# Altium project PCB Blue Pill.PrjPcb
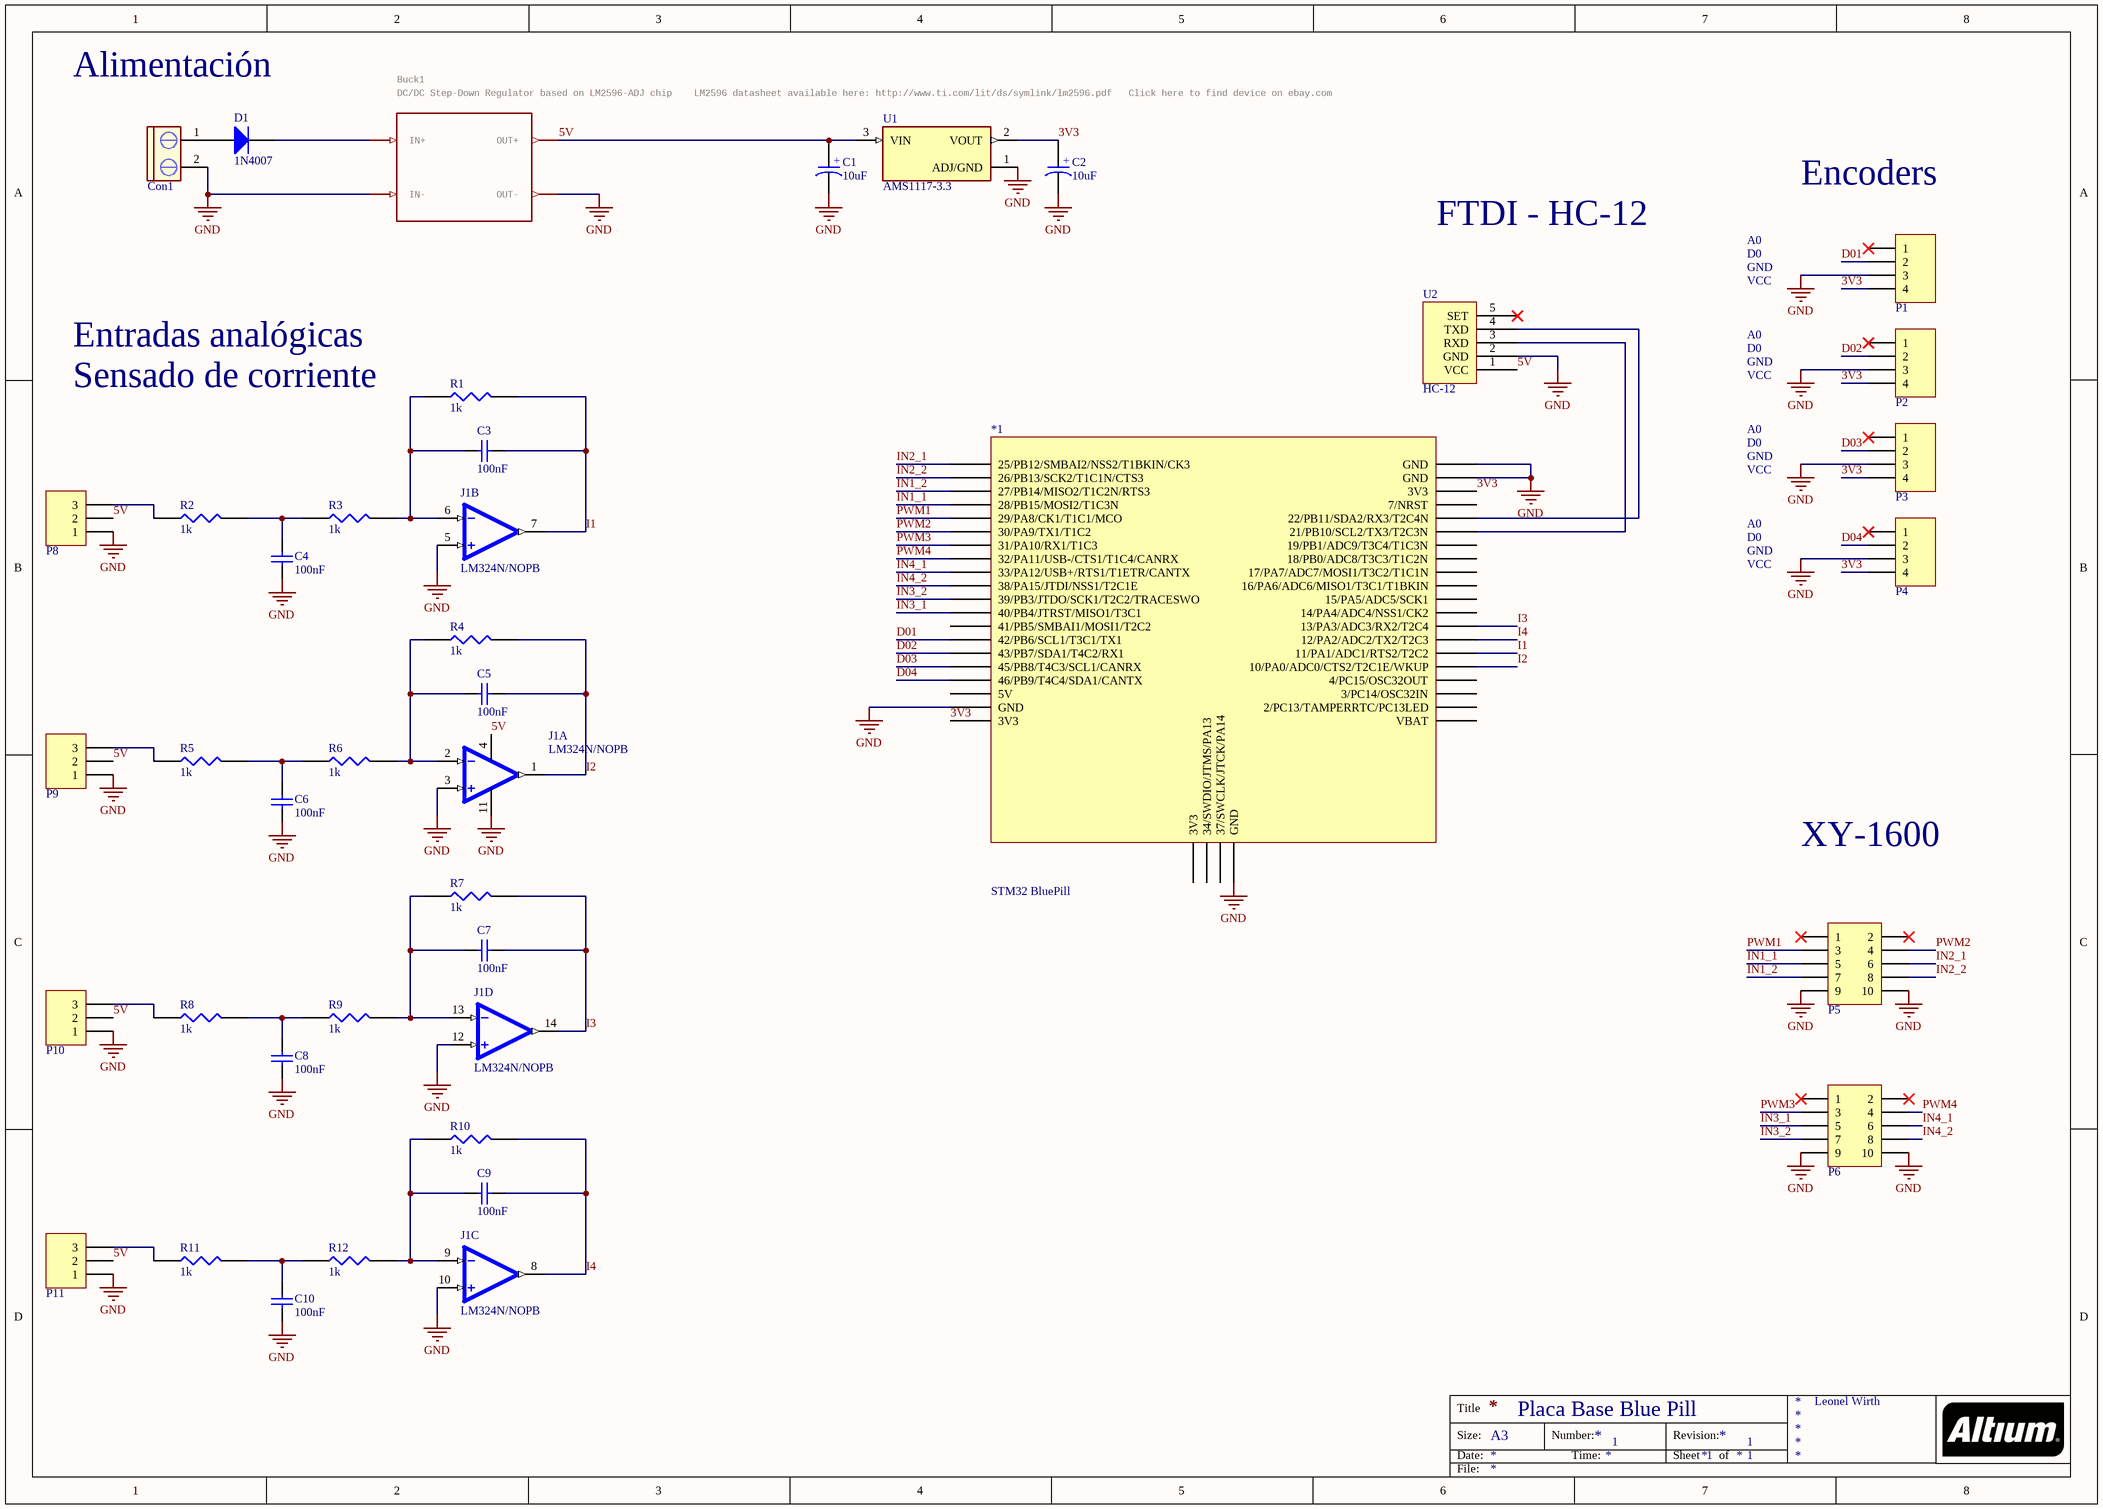
[diagram p0: Placa Base Blue Pill.SchDoc]
1 sheet, 39 parts. Net scope: global (net labels, ports and power ports of the same name join across sheets).
Board file: PCB Placa Base Blue Pill.PcbDoc

## Sheet Placa Base Blue Pill.SchDoc
size A3

### Parts
*1  STM32 BluePill  [STM32 BluePill]
Buck1  DC/DC Step-Down Regulator based on LM2596-ADJ chip    LM2596 datasheet available here: http://www.ti.com/lit/ds/symlink/lm2596.pdf   Click here to find device on ebay.com  [DC-DC-STEP-DOWN-LM2596]
C1  value 10uF  [CAPRADIAL 6.3X11 - 10u]  (hidden comment: CAP- ELECT)
C2  value 10uF  [CAPRADIAL 6.3X11 - 10u]  (hidden comment: CAP- ELECT)
C3  value 100nF  [CAP - LENTEJA]  (hidden comment: Cap)
C4  value 100nF  [CAP - LENTEJA]  (hidden comment: Cap)
C5  value 100nF  [CAP - LENTEJA]  (hidden comment: Cap)
C6  value 100nF  [CAP - LENTEJA]  (hidden comment: Cap)
C7  value 100nF  [CAP - LENTEJA]  (hidden comment: Cap)
C8  value 100nF  [CAP - LENTEJA]  (hidden comment: Cap)
C9  value 100nF  [CAP - LENTEJA]  (hidden comment: Cap)
C10  value 100nF  [CAP - LENTEJA]  (hidden comment: Cap)
Con1  CON2 pin blue  [BORNE 2P]  (value not drawn)
D1  1N4007  [DO - 41]
J1  LM324N/NOPB  [DIP825W47P254L1917H533Q14]  (parts A,B,C,D of 4)
P1  Header 4  [1X04]  (value not drawn)
P2  Header 4  [1X04]  (value not drawn)
P3  Header 4  [1X04]  (value not drawn)
P4  Header 4  [1X04]  (value not drawn)
P5  Header 5x2  [2x05 header]  (value not drawn)
P6  Header 5x2  [2x05 header]  (value not drawn)
P8  Header 3  [1X03]  (value not drawn)
P9  Header 3  [1X03]  (value not drawn)
P10  Header 3  [1X03]  (value not drawn)
P11  Header 3  [1X03]  (value not drawn)
R1  1k  [RES 1/4]
R2  1k  [RES 1/4]
R3  1k  [RES 1/4]
R4  1k  [RES 1/4]
R5  1k  [RES 1/4]
R6  1k  [RES 1/4]
R7  1k  [RES 1/4]
R8  1k  [RES 1/4]
R9  1k  [RES 1/4]
R10  1k  [RES 1/4]
R11  1k  [RES 1/4]
R12  1k  [RES 1/4]
U1  AMS1117-3.3  [SOT229P700X180-4N]
U2  HC-12  [HC12]

### Nets
GND: *1.1(GND) *1.2(GND) *1.21(GND) *1.26(GND) Buck1.IN- Buck1.OUT- C1.2 C2.2 C4.1 C6.1 C8.1 C10.1 Con1.2 J1.3(1IN+) J1.5(2IN+) J1.10(3IN+) J1.11(GND) J1.12(4IN+) P1.3 P2.3 P3.3 P4.3 P5.9 P5.10 P6.9 P6.10 P8.1 P9.1 P10.1 P11.1 U1.1(ADJ/GND) U2.2(GND)
3V3: *1.3(3V3) *1.25(3V3) C2.1 P1.4 P2.4 P3.4 P4.4 U1.2(VOUT)
5V: Buck1.OUT+ C1.1 J1.4(V+) P8.2 P9.2 P10.2 P11.2 U1.3(VIN) U2.1(VCC)
D01: *1.31(42/PB6/SCL1/T3C1/TX1) P1.2
D02: *1.30(43/PB7/SDA1/T4C2/RX1) P2.2
D03: *1.29(45/PB8/T4C3/SCL1/CANRX) P3.2
D04: *1.28(46/PB9/T4C4/SDA1/CANTX) P4.2
I1: *1.15(11/PA1/ADC1/RTS2/T2C2) C3.2 J1.7(2OUT) R1.2
I2: *1.16(10/PA0/ADC0/CTS2/T2C1E/WKUP) C5.2 J1.1(1OUT) R4.2
I3: *1.13(13/PA3/ADC3/RX2/T2C4) C7.2 J1.14(4OUT) R7.2
I4: *1.14(12/PA2/ADC2/TX2/T2C3) C9.2 J1.8(3OUT) R10.2
IN1_1: *1.41(28/PB15/MOSI2/T1C3N) P5.5
IN1_2: *1.42(27/PB14/MISO2/T1C2N/RTS3) P5.7
IN2_1: *1.44(25/PB12/SMBAI2/NSS2/T1BKIN/CK3) P5.6
IN2_2: *1.43(26/PB13/SCK2/T1C1N/CTS3) P5.8
IN3_1: *1.33(40/PB4/JTRST/MISO1/T3C1) P6.5
IN3_2: *1.34(39/PB3/JTDO/SCK1/T2C2/TRACESWO) P6.7
IN4_1: *1.36(33/PA12/USB+/RTS1/T1ETR/CANTX) P6.6
IN4_2: *1.35(38/PA15/JTDI/NSS1/T2C1E) P6.8
PWM1: *1.40(29/PA8/CK1/T1C1/MCO) P5.3
PWM2: *1.39(30/PA9/TX1/T1C2) P5.4
PWM3: *1.38(31/PA10/RX1/T1C3) P6.3
PWM4: *1.37(32/PA11/USB-/CTS1/T1C4/CANRX) P6.4
Net*1_5: *1.5(22/PB11/SDA2/RX3/T2C4N) U2.4(TXD)
Net*1_6: *1.6(21/PB10/SCL2/TX3/T2C3N) U2.3(RXD)
NetBuck1_IN+: Buck1.IN+ D1.K
NetC3_1: C3.1 J1.6(2IN-) R1.1 R3.2
NetC4_2: C4.2 R2.2 R3.1
NetC5_1: C5.1 J1.2(1IN-) R4.1 R6.2
NetC6_2: C6.2 R5.2 R6.1
NetC7_1: C7.1 J1.13(4IN-) R7.1 R9.2
NetC8_2: C8.2 R8.2 R9.1
NetC9_1: C9.1 J1.9(3IN-) R10.1 R12.2
NetC10_2: C10.2 R11.2 R12.1
NetCon1_1: Con1.1 D1.A
NetP8_3: P8.3 R2.1
NetP9_3: P9.3 R5.1
NetP10_3: P10.3 R8.1
NetP11_3: P11.3 R11.1

Not connected (* = marked no-connect by the designer): *1 4(7/NRST) 7(19/PB1/ADC9/T3C4/T1C3N) 8(18/PB0/ADC8/T3C3/T1C2N) 9(17/PA7/ADC7/MOSI1/T3C2/T1C1N) 10(16/PA6/ADC6/MISO1/T3C1/T1BKIN) 11(15/PA5/ADC5/SCK1) 12(14/PA4/ADC4/NSS1/CK2) 17(4/PC15/OSC32OUT) 18(3/PC14/OSC32IN) 19(2/PC13/TAMPERRTC/PC13LED) 20(VBAT) 22(37/SWCLK/JTCK/PA14) 23(34/SWDIO/JTMS/PA13) 24(3V3) 27(5V) 32(41/PB5/SMBAI1/MOSI1/T2C2); P1 1*; P2 1*; P3 1*; P4 1*; P5 1* 2*; P6 1* 2*; U2 5(SET)*

### Notes on the sheet
- Alimentación
- FTDI - HC-12
- A0
- Encoders
- D0
- GND
- VCC
- (near R1) Entradas analógicas
- (near R1) Sensado de corriente
- XY-1600
- Placa Base Blue Pill
- 1
- Leonel Wirth
- Title
- Size:
- Date:
- A3
- Number:
- Time:
- Revision:
- Sheet
- of
- File:
- (in symbol Capacitor Electrolitico) +

### Library data of the parts
Buck1 = DC-DC-STEP-DOWN-LM2596: Step Down; GateName_1: G$1; SymbolName_1: DC-DC-STEP-DOWN-LM2596; LibraryName: diy-modules (1); DeviceSetName: DC-DC-STEP-DOWN-LM2596; Package: DC-DC-STEP-DOWN-LM2596
C1 C2 = Capacitor Electrolitico: CAP_AXIAL
C3-C10 = Capacitor Ceramico: CAP-100nf
Con1 = CON2 pin blue: Connector blue screw
D1 = 1N4007: 1 Amp Diode
J1 = LM324N/NOPB: MF: {'manufacturer': u'Texas Instruments'}; Value: *; MP: LM324N/NOPB; Package: None; Availability: Unavailable; Price: None
P1-P4 = Header 4: Header, 4-Pin; LatestRevisionDate: 17-Jul-2002; LatestRevisionNote: Re-released for DXP Platform.; Publisher: Altium Limited
P5 P6 = Header 5x2: Header, 5-Pin, Dual row
P8-P11 = Header 3: Header, 3-Pin; LatestRevisionDate: 17-Jul-2002; LatestRevisionNote: Re-released for DXP Platform.; Publisher: Altium Limited
R1-R12 = Res: resistor; Value: 1k
U1 = AMS1117-3.3: Sot223/Pkg 1-Amp 3.3-Volt Low Drop Out Voltage Regulatator; MF: {'manufacturer': u'NEC'}; Package: None; Price: None; MP: AMS1117-3.3; Availability: Unavailable; Value: *